# EAGLE schematic EEZ DIB DCP405 r3B3a (EAGLE 7.2.0)
Assembly variants: Farnell, TME

## Sheet 1 of 6: Power pre-regulator
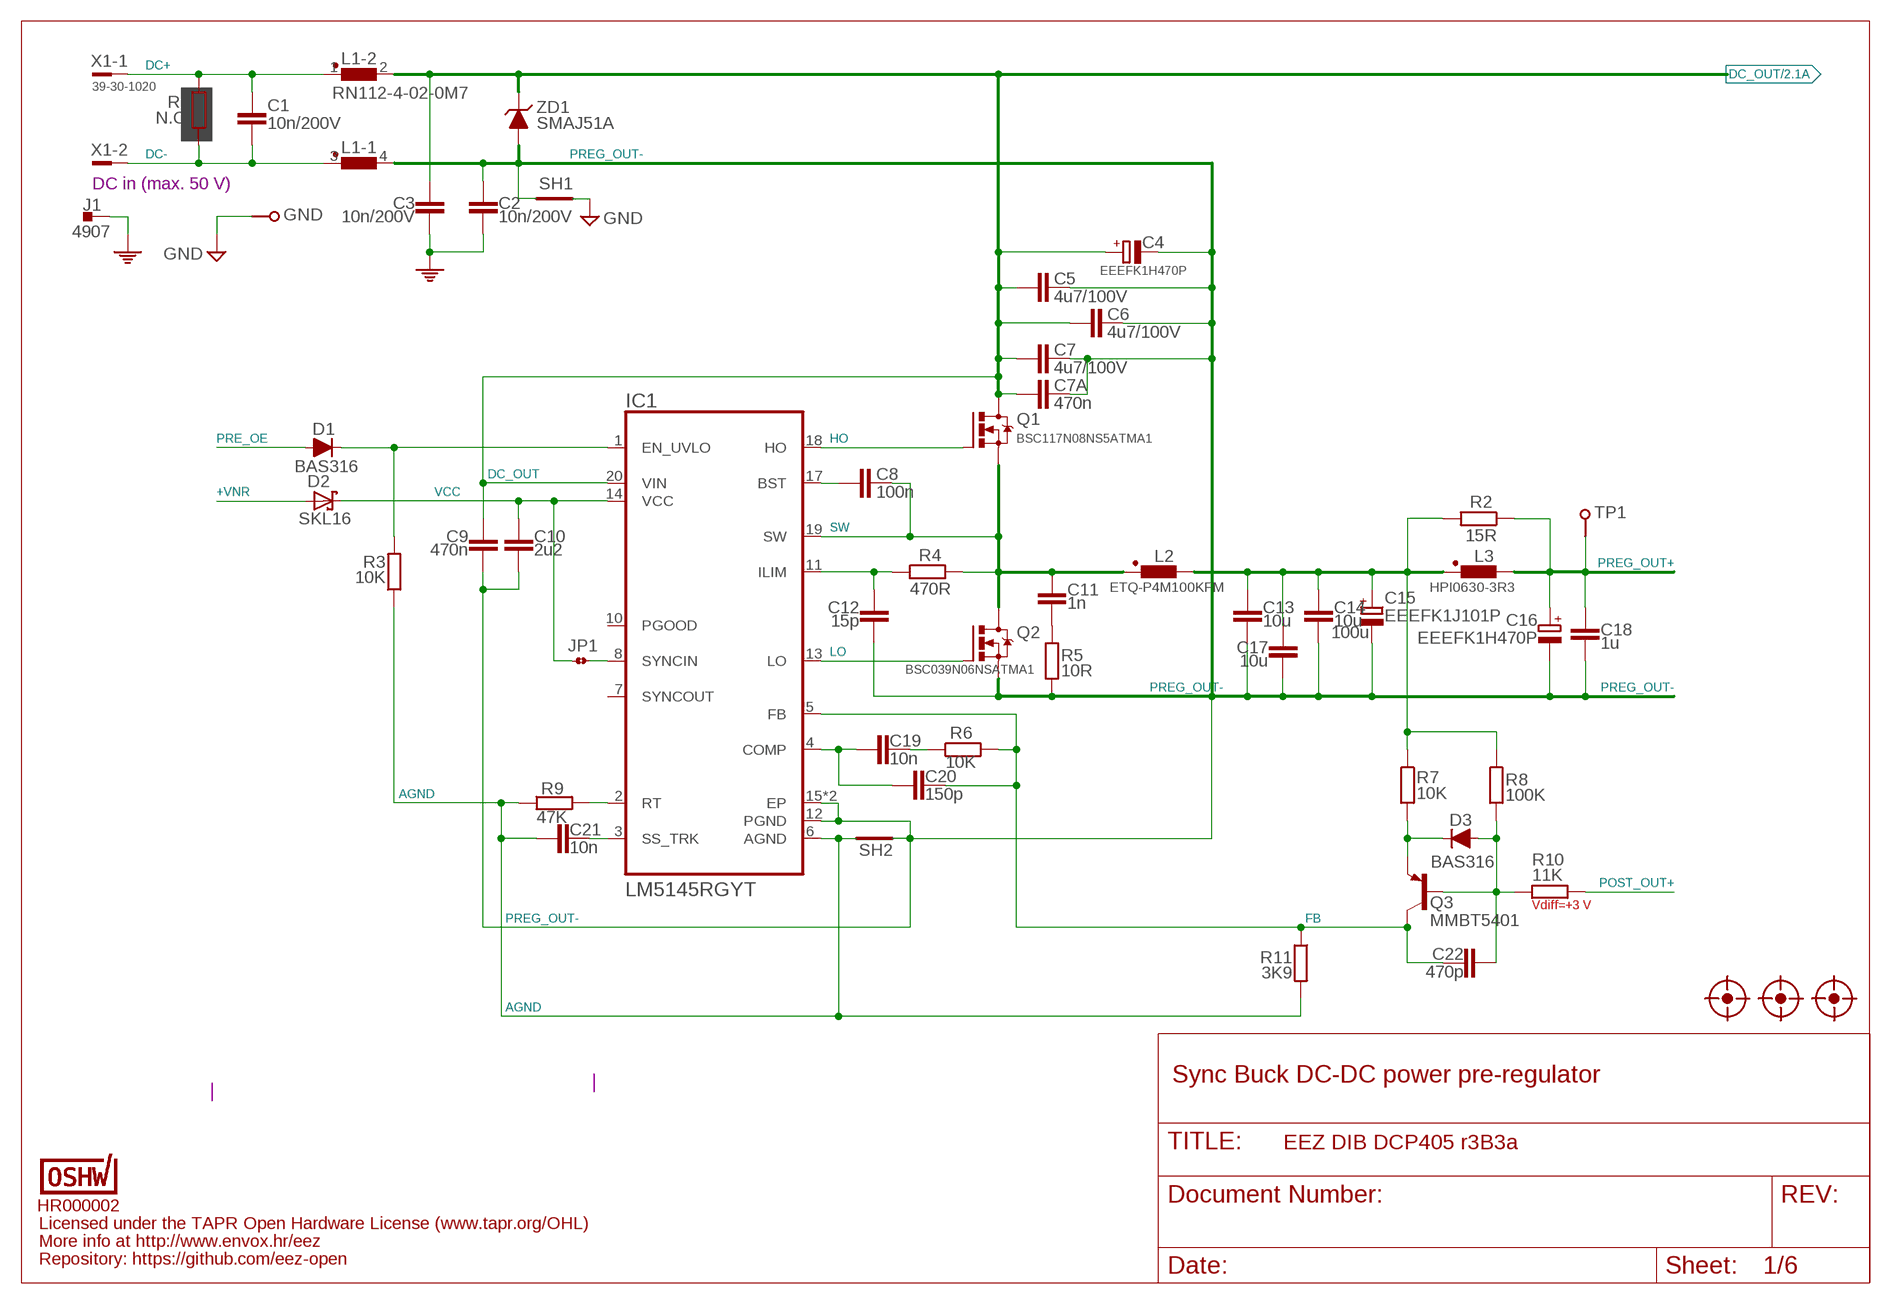
[diagram p0: schematic, sheet 1]

### Parts
C1  10n/200V  C-EUC1206  [C1206]
C2  10n/200V  C-EUC1206  [C1206]
C3  10n/200V  C-EUC1206  [C1206]
C4  EEEFK1H470P  ECAPSMD8.3MM/HA0  [CAPAE830X1050N]
C5  4u7/100V  C-EUC1210  [C1210]
C6  4u7/100V  C-EUC1210  [C1210]
C7  4u7/100V  C-EUC1210  [C1210]
C7A  470n  C-EUC0805  [C0805]
C8  100n  C-EUC0603  [C0603]
C9  470n  C-EUC0805  [C0805]
C10  2u2  C-EUC1206  [C1206]
C11  1n  C-EUC0805  [C0805]
C12  15p  C-EUC0805  [C0805]
C13  10u  C-EUC1210  [C1210]
C14  10u  C-EUC1210  [C1210]
C15  EEEFK1J101P  ECAP10X10  [CAPAE1030X1050N]
C16  EEEFK1H470P  ECAPSMD8.3MM/HA0  [CAPAE830X1050N]
C17  10u  C-EUC1210  [C1210]
C18  1u  C-EUC0805  [C0805]
C19  10n  C-EUC0805  [C0805]
C20  150p  C-EUC0805  [C0805]
C21  10n  C-EUC0805  [C0805]
C22  470p  C-EUC0805  [C0805]
D1  BAS316  DIODESOD323R  [SOD323-R]
D2  SKL16  SCHOTTKYSOD123  [SOD123]
D3  BAS316  DIODESOD323R  [SOD323-R]
FM1  FIDUCIAL_2  [FIDUCIAL_DUAL]
FM2  FIDUCIAL_2  [FIDUCIAL_DUAL]
FM3  FIDUCIAL_2  [FIDUCIAL_DUAL]
GND  PCB_TEST_TABSHIELD  [PCB_SHIELD_TAB]
IC1  LM5145RGYT  LM5145RGYR  [RGY0020B]
J1  4907  PCB_TAB-4907  [PCB_TAB-4907]
JP1  JP2-CUT-0805  [R_0805]
L1  RN112-4-02-0M7  RN112  [RN112]
L2  ETQ-P4M100KFM  PANASONIC_ETQ-P4_KFM  [PANASONIC_ETQ-P4_KFM]
L3  HPI0630-3R3  COILCRAFT_HPI0630  [COILCRAFT_HPI0630]
OSHWA  HR000002  OSHWA-CERT-SMALL  [CERT-SMALL-SILK]
Q1  BSC117N08NS5ATMA1  N-MOSFETTDSON-8  [TDSON-8]
Q2  BSC039N06NSATMA1  N-MOSFETTDSON-8  [TDSON-8]
Q3  MMBT5401  BC857B-PNP-SOT23-BEC  [SOT23-BEC]
R1  N.C.  R-EU_R2512  [R2512]
R2  15R  R-EU_R2010  [R2010]
R3  10K  R-EU_R0805  [R0805]
R4  470R  R-EU_R0805  [R0805]
R5  10R  R-EU_R1206  [R1206]
R6  10K  R-EU_R0805  [R0805]
R7  10K  R-EU_R0805  [R0805]
R8  100K  R-EU_R0805  [R0805]
R9  47K  R-EU_R0805  [R0805]
R10  11K  R-EU_R0805  [R0805]
R11  3K9  R-EU_R0805  [R0805]
SH1  SHORTNOHOLE  [SHORT_NOHOLE]
SH2  SHORTNOHOLE  [SHORT_NOHOLE]
TP1  TEST-PIN_0.9MM  [TEST-PIN_0.9MM]
X1  39-30-1020  MINIFIT_39301020  [MINIFIT_39301020]
ZD1  SMAJ51A  P6SMB68A  [DO214AA]

### Nets
+VNR: D2.A ; also sheet 2
AGND: C21.2 IC1.6(AGND) R3.1 R9.1 R11.2 SH2.1(GND_A)
DC+: C1.2 L1.1 R1.2 X1.1
DC-: C1.1 L1.3 R1.1 X1.2
DC_OUT: C3.2 C4.+ C5.1 C6.1 C7.1 C7A.2 C9.2 IC1.20(VIN) L1.2 Q1.5(D) Q1.6(D) Q1.7(D) Q1.8(D) ZD1.C ; also sheet 2
FB: C20.1 C22.1 IC1.5(FB) Q3.C R6.2 R11.1
GND: GND.1 SH1.2(GND_B) ; also sheet 2,3,4,5,6
HO: IC1.18(HO) Q1.4(G)
L_OUT: C13.1 C14.1 C15.+ C17.1 L2.2 L3.1 R2.2 R7.1 R8.1
LO: IC1.13(LO) Q2.4(G)
N$7: IC1.8(SYNCIN) JP1.2
N$8: D1.C IC1.1(EN_UVLO) R3.2
N$16: D3.C Q3.E R7.2
N$38: C19.1 R6.1
N$40: C8.1 IC1.17(BST)
N$43: IC1.2(RT) R9.2
N$45: C19.2 C20.2 IC1.4(COMP)
N$46: C12.1 IC1.11(ILIM) R4.1
N$53: C21.1 IC1.3(SS_TRK)
N$59: C11.2 R5.2
N$79: C22.2 D3.A Q3.B R8.2 R10.1
PE: C2.2 C3.1 J1.1 J1.2 ; also sheet 6
POST_OUT+: R10.2 ; also sheet 3,6
PRE_OE: D1.A ; also sheet 4
PREG_OUT+: C16.+ C18.2 L3.2 R2.1 TP1.1 ; also sheet 3
PREG_OUT-: C2.1 C4.- C5.2 C6.2 C7.2 C7A.1 C9.1 C10.1 C12.2 C13.2 C14.2 C15.- C16.- C17.2 C18.1 IC1.12(PGND) IC1.15(EP) IC1.21(EP) L1.4 Q2.1(S) Q2.2(S) Q2.3(S) R5.1 SH1.1(GND_A) SH2.2(GND_B) ZD1.A ; also sheet 3
SW: C8.2 C11.1 IC1.19(SW) L2.1 Q1.1(S) Q1.2(S) Q1.3(S) Q2.5(D) Q2.6(D) Q2.7(D) Q2.8(D) R4.2
VCC: C10.2 D2.C IC1.14(VCC) JP1.1
Unconnected: IC1.7(SYNCOUT) IC1.10(PGOOD)

### Notes on the sheet
- DC in (max. 50 V)
- 100u
- Vdiff=+3 V
- Sync Buck DC-DC power pre-regulator
- Licensed under the TAPR Open Hardware License (www.tapr.org/OHL)
- More info at http://www.envox.hr/eez
- Repository: https://github.com/eez-open

## Sheet 2 of 6: Bias power, DIB interface
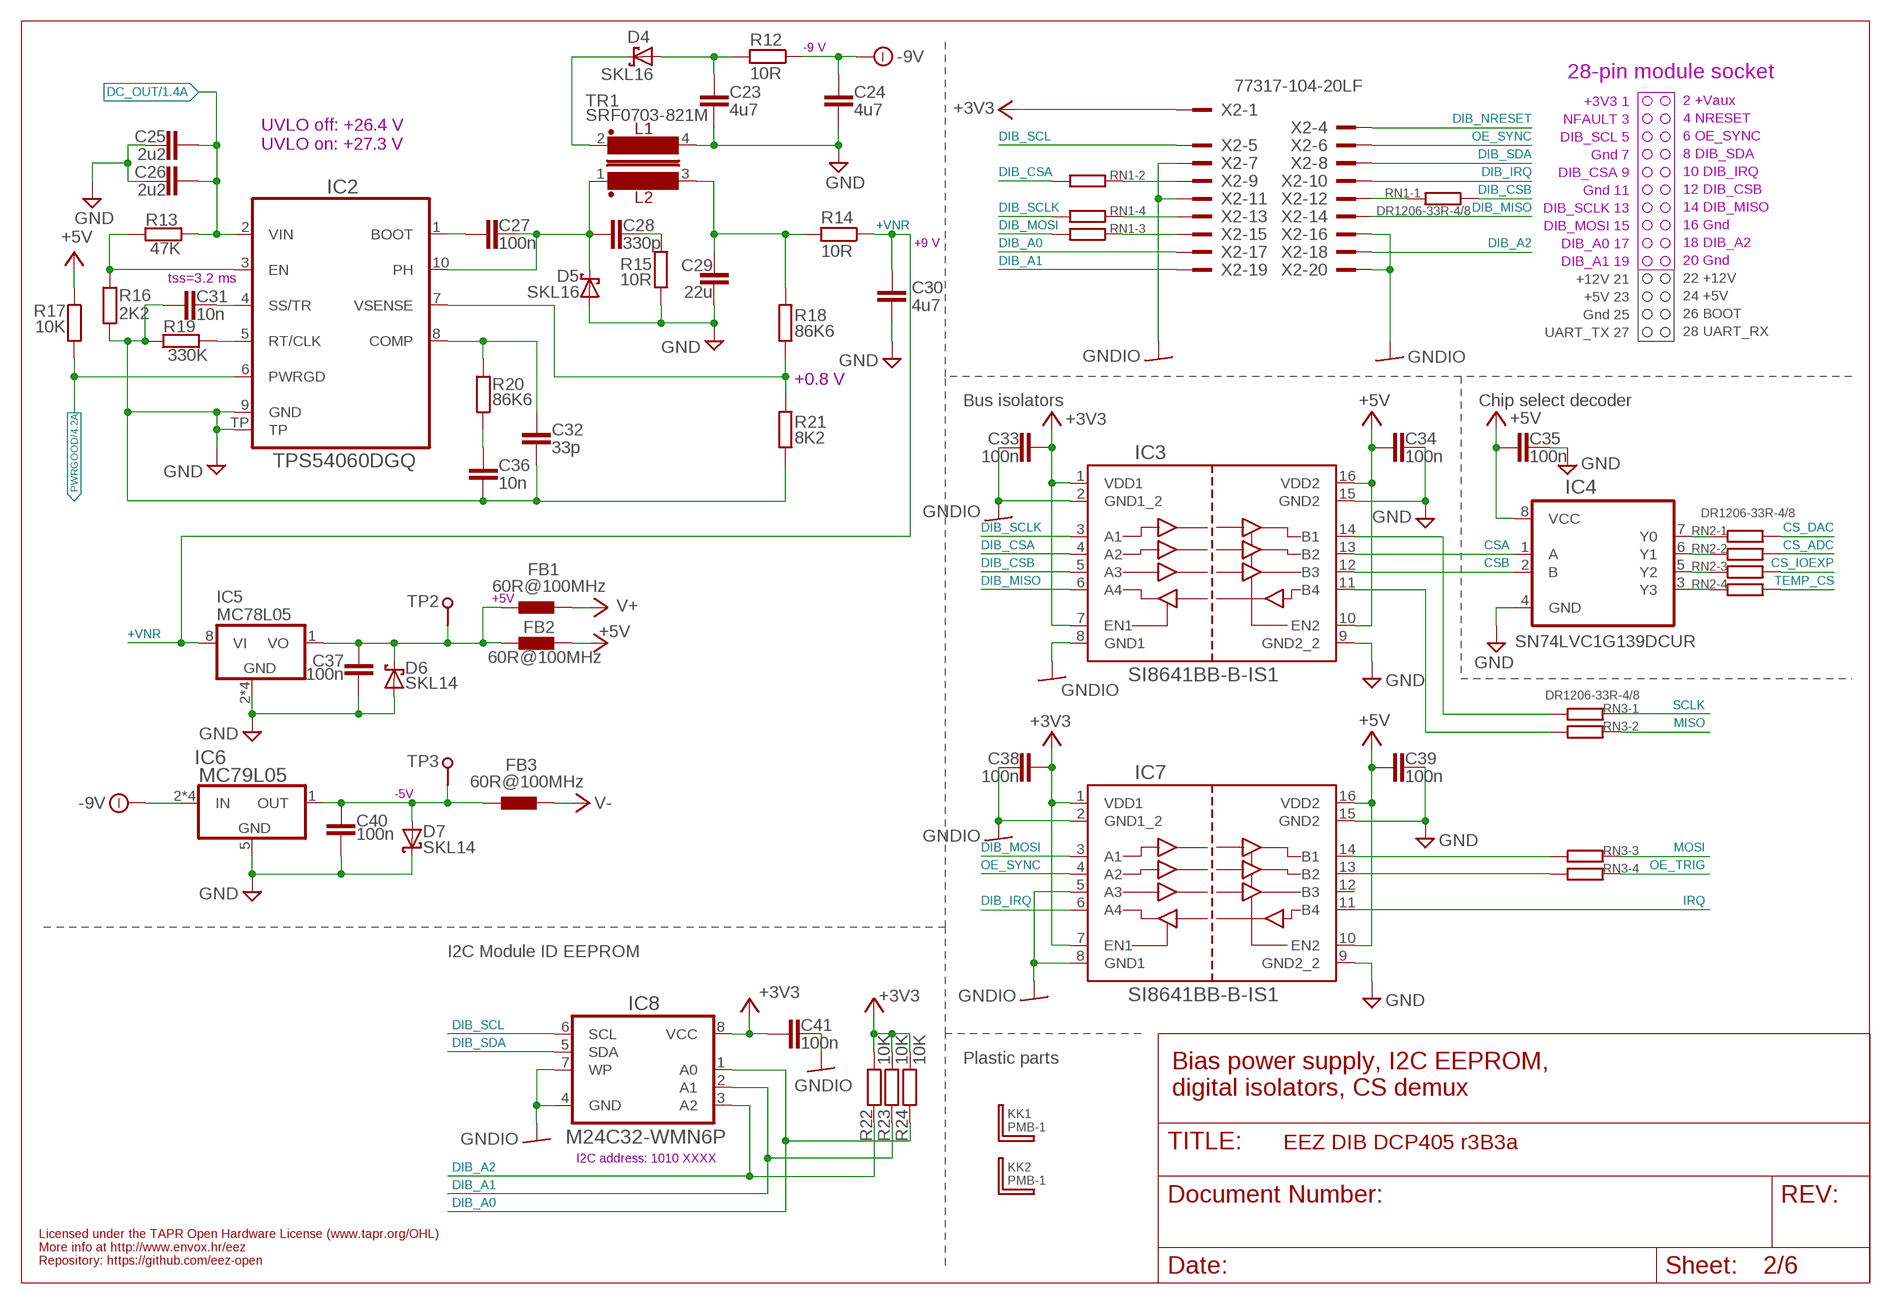
[diagram p1: schematic, sheet 2]

### Parts
C23  4u7  C-EUC1206  [C1206]
C24  4u7  C-EUC1206  [C1206]
C25  2u2  C-EUC1206  [C1206]
C26  2u2  C-EUC1206  [C1206]
C27  100n  C-EUC0603  [C0603]
C28  330p  C-EUC0805  [C0805]
C29  22u  C-EUC1210  [C1210]
C30  4u7  C-EUC1206  [C1206]
C31  10n  C-EUC0805  [C0805]
C32  33p  C-EUC0805  [C0805]
C33  100n  C-EUC0603  [C0603]
C34  100n  C-EUC0603  [C0603]
C35  100n  C-EUC0603  [C0603]
C36  10n  C-EUC0805  [C0805]
C37  100n  C-EUC0603  [C0603]
C38  100n  C-EUC0603  [C0603]
C39  100n  C-EUC0603  [C0603]
C40  100n  C-EUC0603  [C0603]
C41  100n  C-EUC0603  [C0603]
D4  SKL16  SCHOTTKYSOD123  [SOD123]
D5  SKL16  SCHOTTKYSOD123  [SOD123]
D6  SKL14  SCHOTTKYSOD123  [SOD123]
D7  SKL14  SCHOTTKYSOD123  [SOD123]
FB1  60R@100MHz  FERRITE_BEAD0603  [BEAD0603]
FB2  60R@100MHz  FERRITE_BEAD0603  [BEAD0603]
FB3  60R@100MHz  FERRITE_BEAD0603  [BEAD0603]
IC2  TPS54060DGQ  [SOP50P490X110-11N]
IC3  SI8641BB-B-IS1  SI8641NSOIC-16  [SOIC-16]
IC4  SN74LVC1G139DCUR  SN74LVC1G139-VSSOP  [DCU8]
IC5  MC78L05  MC78LXXSOIC8  [SOIC127P600X173-8N]
IC6  MC79L05  MC79LXXSOIC  [SOIC127P600X173-8N]
IC7  SI8641BB-B-IS1  SI8641NSOIC-16  [SOIC-16]
IC8  M24C32-WMN6P  AT24CXXSOIC8  [SOIC127P600X173-8N]
KK1  PMB-1  PCB-MB  [PCB-MB]
KK2  PMB-1  PCB-MB  [PCB-MB]
R12  10R  R-EU_R1206  [R1206]
R13  47K  R-EU_R0805  [R0805]
R14  10R  R-EU_R1206  [R1206]
R15  10R  R-EU_R1206  [R1206]
R16  2K2  R-EU_R0805  [R0805]
R17  10K  R-EU_R0805  [R0805]
R18  86K6  R-EU_R0805  [R0805]
R19  330K  R-EU_R0805  [R0805]
R20  86K6  R-EU_R0805  [R0805]
R21  8K2  R-EU_R0805  [R0805]
R22  10K  R-EU_R0805  [R0805]
R23  10K  R-EU_R0805  [R0805]
R24  10K  R-EU_R0805  [R0805]
RN1  DR1206-33R-4/8  R_ARRAY4  [CAY16]
RN2  DR1206-33R-4/8  R_ARRAY4  [CAY16]
RN3  DR1206-33R-4/8  R_ARRAY4  [CAY16]
TP2  TEST-PIN_0.9MM  [TEST-PIN_0.9MM]
TP3  TEST-PIN_0.9MM  [TEST-PIN_0.9MM]
TR1  SRF0703-821M  BOURNS_SRF0703INV  [SRF0703]
X2  77317-104-20LF  [77317-104-20LF]

### Nets
+3V3: C33.1 C38.1 C41.2 IC3.1(VDD1) IC3.7(EN1) IC7.1(VDD1) IC7.7(EN1) IC8.8(VCC) R22.1 R23.1 R24.1 X2.1
+5V: C34.2 C35.1 C39.2 FB2.P$2 IC3.10(EN2) IC3.16(VDD2) IC4.8(VCC) IC7.10(EN2) IC7.16(VDD2) R17.1 ; also sheet 4,5,6
+5VOUT: C37.1 D6.C FB1.P$1 FB2.P$1 IC5.1(VO) TP2.1
+VNR: C30.1 IC5.8(VI) R14.1 ; also sheet 1
-9V: C24.1 IC6.2(IN) IC6.3(IN) IC6.6(IN) IC6.7(IN) R12.1 ; also sheet 3
CS_ADC: RN2.7 ; also sheet 4
CS_DAC: RN2.8 ; also sheet 4
CS_IOEXP: RN2.6 ; also sheet 4
CSA: IC3.13(B2) IC4.1(A)
CSB: IC3.12(B3) IC4.2(B)
DC_OUT: C25.1 C26.1 IC2.2(VIN) R13.2 ; also sheet 1
DIB_A0: IC8.1(A0) R24.2 X2.17
DIB_A1: IC8.2(A1) R23.2 X2.19
DIB_A2: IC8.3(A2) R22.2 X2.18
DIB_CSA: IC3.4(A2) RN1.2
DIB_CSB: IC3.5(A3) RN1.1
DIB_IRQ: IC7.6(A4) X2.10
DIB_MISO: IC3.6(A4) X2.14
DIB_MOSI: IC7.3(A1) RN1.3
DIB_NRESET: X2.4
DIB_SCL: IC8.6(SCL) X2.5
DIB_SCLK: IC3.3(A1) RN1.4
DIB_SDA: IC8.5(SDA) X2.8
GND: C23.2 C24.2 C25.2 C26.2 C29.2 C30.2 C31.2 C32.1 C34.1 C35.2 C36.1 C37.2 C39.1 C40.1 D5.A D6.A D7.C IC2.9(GND) IC2.TP IC3.9(GND2_2) IC3.15(GND2) IC4.4(GND) IC5.2(GND) IC5.3(GND) IC5.6(GND) IC5.7(GND) IC6.5(GND) IC7.9(GND2_2) IC7.15(GND2) R15.1 R16.1 R19.1 R21.1 TR1.4 ; also sheet 1,3,4,5,6
GNDIO: C33.2 C38.2 C41.1 IC3.2(GND1_2) IC3.8(GND1) IC7.2(GND1_2) IC7.5(A3) IC7.8(GND1) IC8.4(GND) IC8.7(WP) X2.7 X2.11 X2.16 X2.20
IRQ: IC7.11(B4) ; also sheet 4
MISO: RN3.7 ; also sheet 4
MOSI: RN3.6 ; also sheet 4
N$3: IC7.13(B2) RN3.4
N$4: IC4.5(Y2) RN2.3
N$6: IC4.7(Y0) RN2.1
N$9: IC3.11(B4) RN3.2
N$15: RN1.7 X2.9
N$22: IC4.6(Y1) RN2.2
N$23: RN1.5 X2.13
N$26: C28.2 R15.2
N$27: RN1.6 X2.15
N$29: C40.2 D7.A FB3.P$1 IC6.1(OUT) TP3.1
N$30: RN1.8 X2.12
N$34: IC2.3(EN) R13.1 R16.2
N$41: C31.1 IC2.4(SS/TR)
N$48: IC2.5(RT/CLK) R19.2
N$50: C32.2 IC2.8(COMP) R20.2
N$51: C36.2 R20.1
N$52: IC4.3(Y3) RN2.4
N$60: C27.2 IC2.1(BOOT)
N$61: IC7.14(B1) RN3.3
N$62: IC2.7(VSENSE) R18.1 R21.2
N$122: IC3.14(B1) RN3.1
N$179: C23.1 D4.A R12.2
OE_SYNC: IC7.4(A2) X2.6
OE_TRIG: RN3.5 ; also sheet 4
PH: C27.1 C28.1 D5.C IC2.10(PH) TR1.1
PWRGOOD: IC2.6(PWRGD) R17.2 ; also sheet 4
SCLK: RN3.8 ; also sheet 4
TEMP_CS: RN2.5 ; also sheet 4
V+: FB1.P$2 ; also sheet 3,4,5
V-: FB3.P$2 ; also sheet 3,5
VOUT+: C29.1 R14.2 R18.2 TR1.3
VOUT-: D4.C TR1.2
Unconnected: IC7.12(B3) X2.2 X2.3

### Notes on the sheet
- -9 V
- 28-pin module socket
- +3V3 1
- 2 +Vaux
- NFAULT 3
- 4 NRESET
- DIB_SCL 5
- 6 OE_SYNC
- UVLO off: +26.4 V
  UVLO on: +27.3 V
- Gnd 7
- 8 DIB_SDA
- DIB_CSA 9
- 10 DIB_IRQ
- Gnd 11
- 12 DIB_CSB
- DIB_SCLK 13
- 14 DIB_MISO
- DIB_MOSI 15
- 16 Gnd
- +9 V | DIB_A0 17
- 18 DIB_A2
- DIB_A1 19
- 20 Gnd
- +12V 21
- tss=3.2 ms | 22 +12V
- +5V 23
- 24 +5V
- Gnd 25
- 26 BOOT
- UART_TX 27
- 28 UART_RX
- +0.8 V
- Bus isolators | Chip select decoder
- +5V
- -5V
- I2C Module ID EEPROM
- Plastic parts
- Bias power supply, I2C EEPROM,
  digital isolators, CS demux
- I2C address: 1010 XXXX
- Licensed under the TAPR Open Hardware License (www.tapr.org/OHL)
- More info at http://www.envox.hr/eez
- Repository: https://github.com/eez-open

## Sheet 3 of 6: Post-regulator
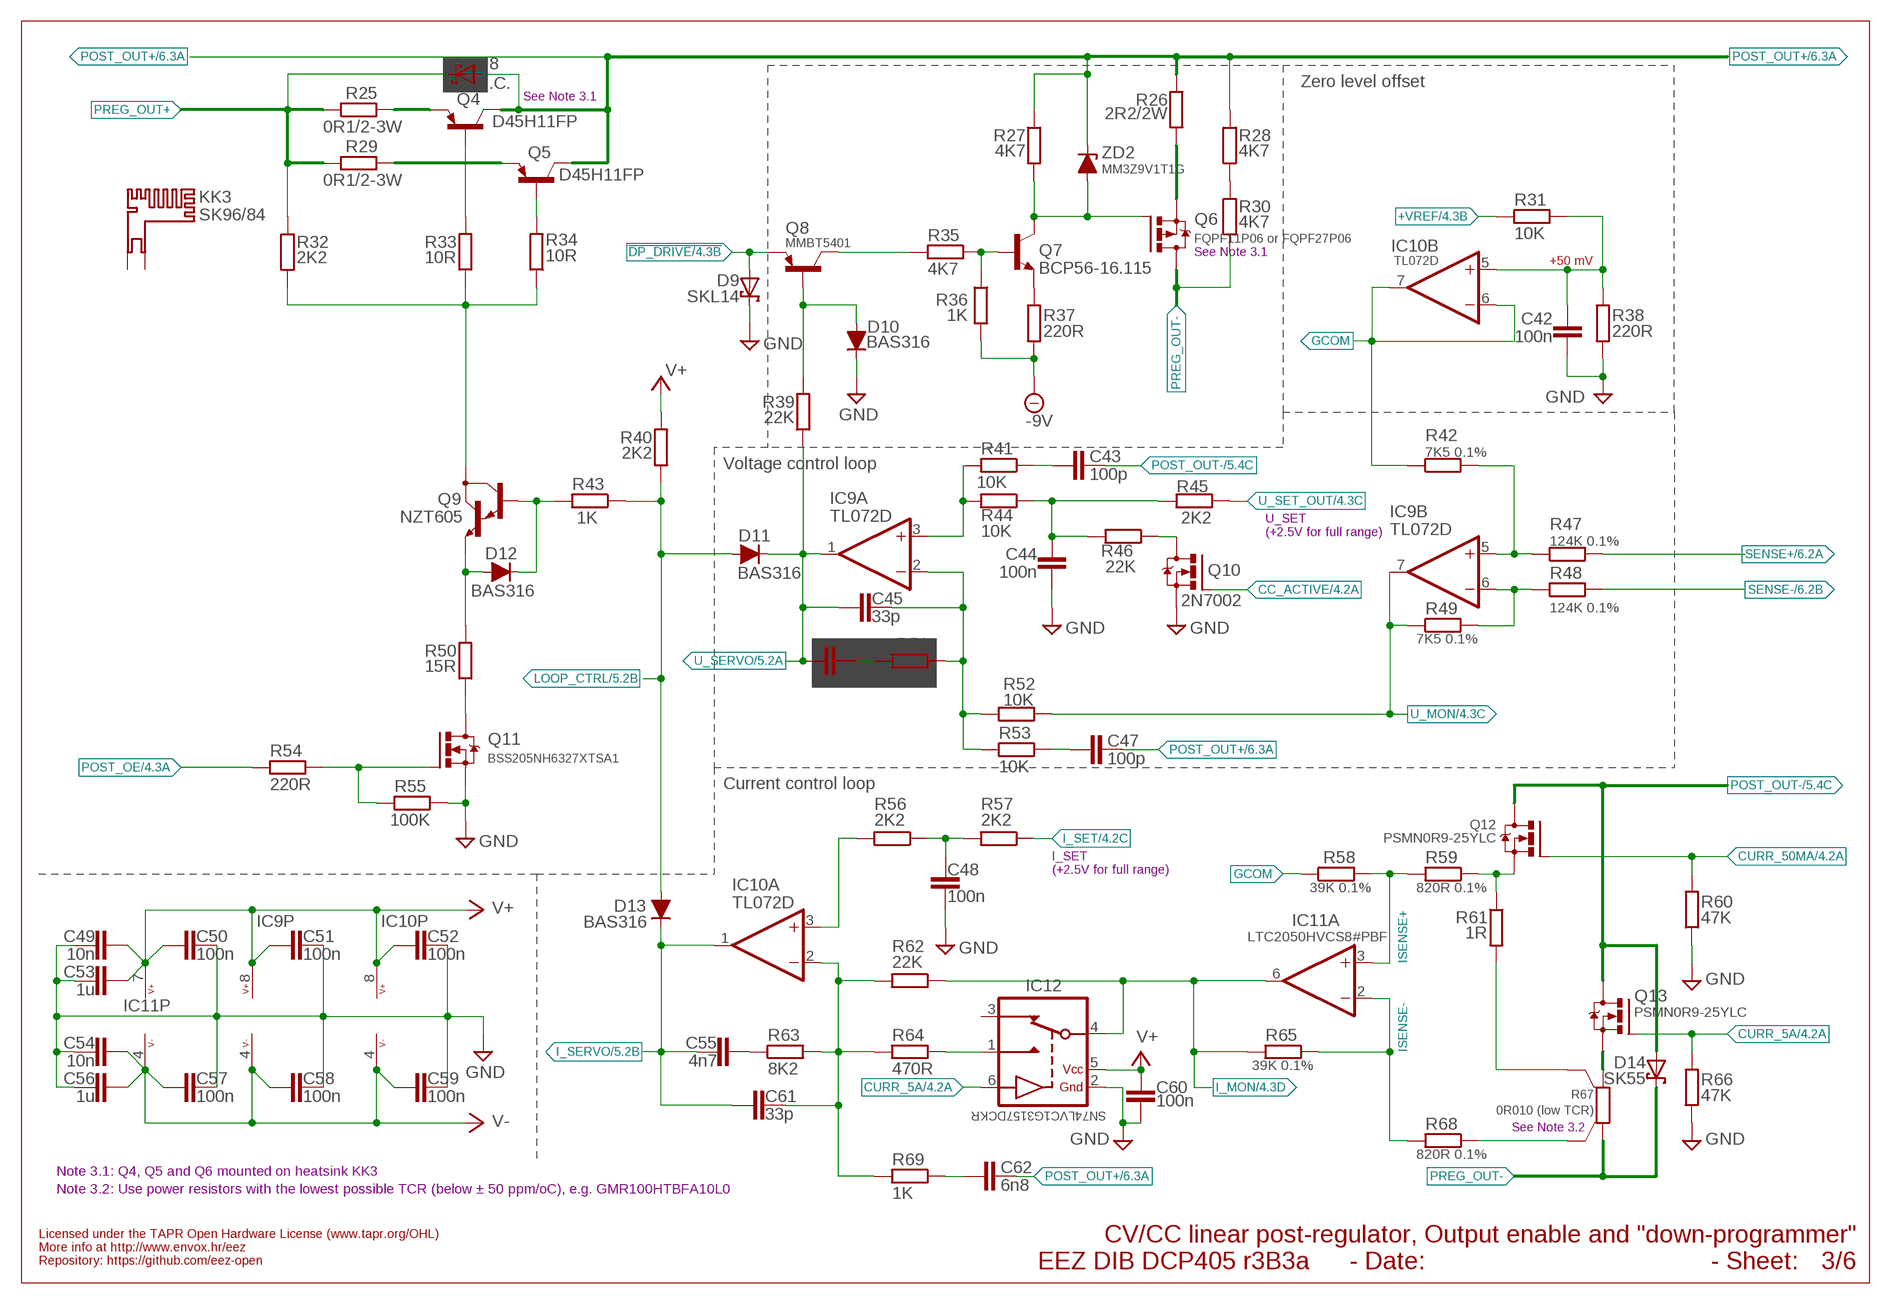
[diagram p2: schematic, sheet 3]

### Parts
C42  100n  C-EUC0603  [C0603]
C43  100p  C-EUC0805  [C0805]
C44  100n  C-EUC0603  [C0603]
C45  33p  C-EUC0805  [C0805]
C46  N.C.  C-EUC0805  [C0805]
C47  100p  C-EUC0805  [C0805]
C48  100n  C-EUC0603  [C0603]
C49  10n  C-EUC0805  [C0805]
C50  100n  C-EUC0603  [C0603]
C51  100n  C-EUC0603  [C0603]
C52  100n  C-EUC0603  [C0603]
C53  1u  C-EUC0805  [C0805]
C54  10n  C-EUC0805  [C0805]
C55  4n7  C-EUC0805  [C0805]
C56  1u  C-EUC0805  [C0805]
C57  100n  C-EUC0603  [C0603]
C58  100n  C-EUC0603  [C0603]
C59  100n  C-EUC0603  [C0603]
C60  100n  C-EUC0603  [C0603]
C61  33p  C-EUC0805  [C0805]
C62  6n8  C-EUC0805  [C0805]
D8  N.C.  SCHOTTKYSOD123  [SOD123]
D9  SKL14  SCHOTTKYSOD123  [SOD123]
D10  BAS316  DIODESOD323R  [SOD323-R]
D11  BAS316  DIODESOD323R  [SOD323-R]
D12  BAS316  DIODESOD323R  [SOD323-R]
D13  BAS316  DIODESOD323R  [SOD323-R]
D14  SK55  SCHOTTKYSMB  [SMB]
IC9  TL072D  TL072SOIC8  [SOIC127P600X173-8N]
IC10  TL072D  TL072SOIC8  [SOIC127P600X173-8N]
IC11  LTC2050HVCS8#PBF  OP27GSZSO8  [SOIC127P600X173-8N]
IC12  SN74LVC1G3157DCKR  SN74LVC1G3157-DCK  [SOT65P210X110-6N]
KK3  SK96/84  [SK96/84]
Q4  D45H11FP  D45H11-FPV  [TO220FP-V]
Q5  D45H11FP  D45H11-FPV  [TO220FP-V]
Q6  FQPF11P06 or FQPF27P06  P-MOSFET-FPV  [TO220FP-V]
Q7  BCP56-16.115  BCP56  [SOT230P700X180-4N]
Q8  MMBT5401  BC857B-PNP-SOT23-BEC  [SOT23-BEC]
Q9  NZT605  [SOT230P700X180-4N]
Q10  2N7002  [SOT103P240X110-3N]
Q11  BSS205NH6327XTSA1  2N7002  [SOT103P240X110-3N]
Q12  PSMN0R9-25YLC  N-MOSFETLFPAK  [SOT669]
Q13  PSMN0R9-25YLC  N-MOSFETLFPAK  [SOT669]
R25  0R1/2-3W  R-EU_R2512  [R2512]
R26  2R2/2W  R-EU_R2512  [R2512]
R27  4K7  R-EU_R0805  [R0805]
R28  4K7  R-EU_R0805  [R0805]
R29  0R1/2-3W  R-EU_R2512  [R2512]
R30  4K7  R-EU_R0805  [R0805]
R31  10K  R-EU_R0805  [R0805]
R32  2K2  R-EU_R0805  [R0805]
R33  10R  R-EU_R1206  [R1206]
R34  10R  R-EU_R1206  [R1206]
R35  4K7  R-EU_R0805  [R0805]
R36  1K  R-EU_R0805  [R0805]
R37  220R  R-EU_R0805  [R0805]
R38  220R  R-EU_R0805  [R0805]
R39  22K  R-EU_R0805  [R0805]
R40  2K2  R-EU_R0805  [R0805]
R41  10K  R-EU_R0805  [R0805]
R42  7K5 0.1%  R-EU_R0805  [R0805]
R43  1K  R-EU_R0805  [R0805]
R44  10K  R-EU_R0805  [R0805]
R45  2K2  R-EU_R0805  [R0805]
R46  22K  R-EU_R0805  [R0805]
R47  124K 0.1%  R-EU_R0805  [R0805]
R48  124K 0.1%  R-EU_R0805  [R0805]
R49  7K5 0.1%  R-EU_R0805  [R0805]
R50  15R  R-EU_R2010  [R2010]
R51  N.C.  R-EU_R0805  [R0805]
R52  10K  R-EU_R0805  [R0805]
R53  10K  R-EU_R0805  [R0805]
R54  220R  R-EU_R0805  [R0805]
R55  100K  R-EU_R0805  [R0805]
R56  2K2  R-EU_R0805  [R0805]
R57  2K2  R-EU_R0805  [R0805]
R58  39K 0.1%  R-EU_R0805  [R0805]
R59  820R 0.1%  R-EU_R0805  [R0805]
R60  47K  R-EU_R0805  [R0805]
R61  1R  R-EU_R1206  [R1206]
R62  22K  R-EU_R0805  [R0805]
R63  8K2  R-EU_R0805  [R0805]
R64  470R  R-EU_R0805  [R0805]
R65  39K 0.1%  R-EU_R0805  [R0805]
R66  47K  R-EU_R0805  [R0805]
R67  0R010 (low TCR)  R-EU_4WIRE2512  [R_2512-4WIRE]
R68  820R 0.1%  R-EU_R0805  [R0805]
R69  1K  R-EU_R0805  [R0805]
ZD2  MM3Z9V1T1G  ZENER-DIODESOD323R  [SOD323-R]

### Nets
5A_S: Q13.1(S) Q13.2(S) Q13.3(S) R67.2
50MA_S: Q12.1(S) Q12.2(S) Q12.3(S) R59.1 R61.1
!DP_DRIVE: D9.A Q8.E ; also sheet 4
+VREF: R31.1 ; also sheet 4
-9V: R36.2 R37.2 ; also sheet 2
CC_ACTIVE: Q10.1(G) ; also sheet 4,5
CURR_5A: IC12.6(CTRL) Q13.4(G) R66.2 ; also sheet 4
CURR_50MA: Q12.4(G) R60.2 ; also sheet 4
DARL_C1: Q9.2(C) Q9.4(C) R32.1 R33.1 R34.1
DP_S: Q6.3(S) R26.1
GCOM: IC10.6(B:-IN) IC10.7(B:OUT) R42.1 R58.1
GND: C42.2 C44.2 C48.2 C49.1 C50.2 C51.1 C52.1 C53.1 C54.1 C56.1 C57.2 C58.1 C59.1 C60.2 D9.C D10.C IC12.2(GND) Q10.2(S) Q11.2(S) R38.2 R55.1 R60.1 R66.1 ; also sheet 1,2,4,5,6
I_MON: IC11.6(A:OUT) IC12.4(COM) R62.1 R65.2 ; also sheet 4
I_SERVO: C55.2 C61.2 D13.C IC10.1(A:OUT) ; also sheet 5
I_SET: R57.1 ; also sheet 4
ISENSE+: IC11.3(A:+IN) R58.2 R59.2
ISENSE-: IC11.2(A:-IN) R65.1 R68.2
LOOP_CTRL: D11.A D13.A R40.1 R43.1 ; also sheet 5
N$2: Q10.3(D) R46.1
N$10: C48.1 R56.1 R57.2
N$11: R61.2 R67.2S
N$14: C46.1 R51.2
N$37: C55.1 R63.1
N$54: Q5.1(B) R34.2
N$57: IC12.1(NO) R64.1
N$82: IC10.3(A:+IN) R56.2
N$83: IC9.3(A:+IN) R41.2 R44.2
N$84: C45.1 IC9.2(A:-IN) R51.1 R52.2 R53.2
N$85: Q4.1(B) R33.2
N$86: D12.A Q9.3(E) R50.2
N$87: Q11.3(D) R50.1
N$88: C62.2 R69.1
N$89: C61.1 IC10.2(A:-IN) R62.2 R63.2 R64.2 R69.2
N$90: C43.2 R41.1
N$91: C47.2 R53.1
N$92: R28.1 R30.2
N$93: Q7.1(B) R35.1 R36.1
N$95: Q8.C R35.2
N$96: D10.A Q8.B R39.2
N$97: Q11.1(G) R54.1 R55.2
N$98: Q7.3(E) R37.1
N$99: D12.C Q9.1(B) R43.2
N$102: C42.1 IC10.5(B:+IN) R31.2 R38.1
N$150: IC9.5(B:+IN) R42.2 R47.1
N$158: IC9.6(B:-IN) R48.1 R49.2
N$200: R67.1S R68.1
PASS_E1: Q4.3(E) R25.2
PASS_E2: Q5.3(E) R29.2
POST_OE: R54.2 ; also sheet 4
POST_OUT+: C47.1 C62.1 D8.A Q4.2(C) Q5.2(C) R26.2 R27.1 R28.2 ZD2.C ; also sheet 1,6
POST_OUT-: C43.1 D14.A Q12.MB(D) Q13.MB(D) ; also sheet 5,6
PREG_OUT+: D8.C R25.1 R29.1 R32.2 ; also sheet 1
PREG_OUT-: D14.C Q6.2(D) R30.1 R67.1 ; also sheet 1
Q7C: Q6.1(G) Q7.2(C) Q7.4(C) R27.2 ZD2.A
SENSE+: R47.2 ; also sheet 6
SENSE-: R48.2 ; also sheet 6
U_MON: IC9.7(B:OUT) R49.1 R52.1 ; also sheet 4,5
U_SERVO: C45.2 C46.2 D11.C IC9.1(A:OUT) R39.1 ; also sheet 5
U_SET_OUT: R45.1 ; also sheet 4,5
U_SET_OVP: C44.1 R44.1 R45.2 R46.2
V+: C49.2 C50.1 C51.2 C52.2 C53.2 C60.1 IC9.8(P:V+) IC10.8(P:V+) IC11.7(P:V+) IC12.5(VDD) R40.2 ; also sheet 2,4,5
V-: C54.2 C56.2 C57.1 C58.2 C59.2 IC9.4(P:V-) IC10.4(P:V-) IC11.4(P:V-) ; also sheet 2,5
Unconnected: IC12.3(NC) KK3.1 KK3.2

### Notes on the sheet
- Zero level offset
- See Note 3.1
- See Note 3.1
- +50 mV
- Voltage control loop
- U_SET
  (+2.5V for full range)
- Current control loop
- I_SET
  (+2.5V for full range)
- See Note 3.2
- Note 3.1: Q4, Q5 and Q6 mounted on heatsink KK3
- Note 3.2: Use power resistors with the lowest possible TCR (below ± 50 ppm/oC), e.g. GMR100HTBFA10L0
- Licensed under the TAPR Open Hardware License (www.tapr.org/OHL)
- CV/CC linear post-regulator, Output enable and "down-programmer"
- More info at http://www.envox.hr/eez
- Repository: https://github.com/eez-open
- - Date: | - Sheet:

## Sheet 4 of 6: Digital control, Vref
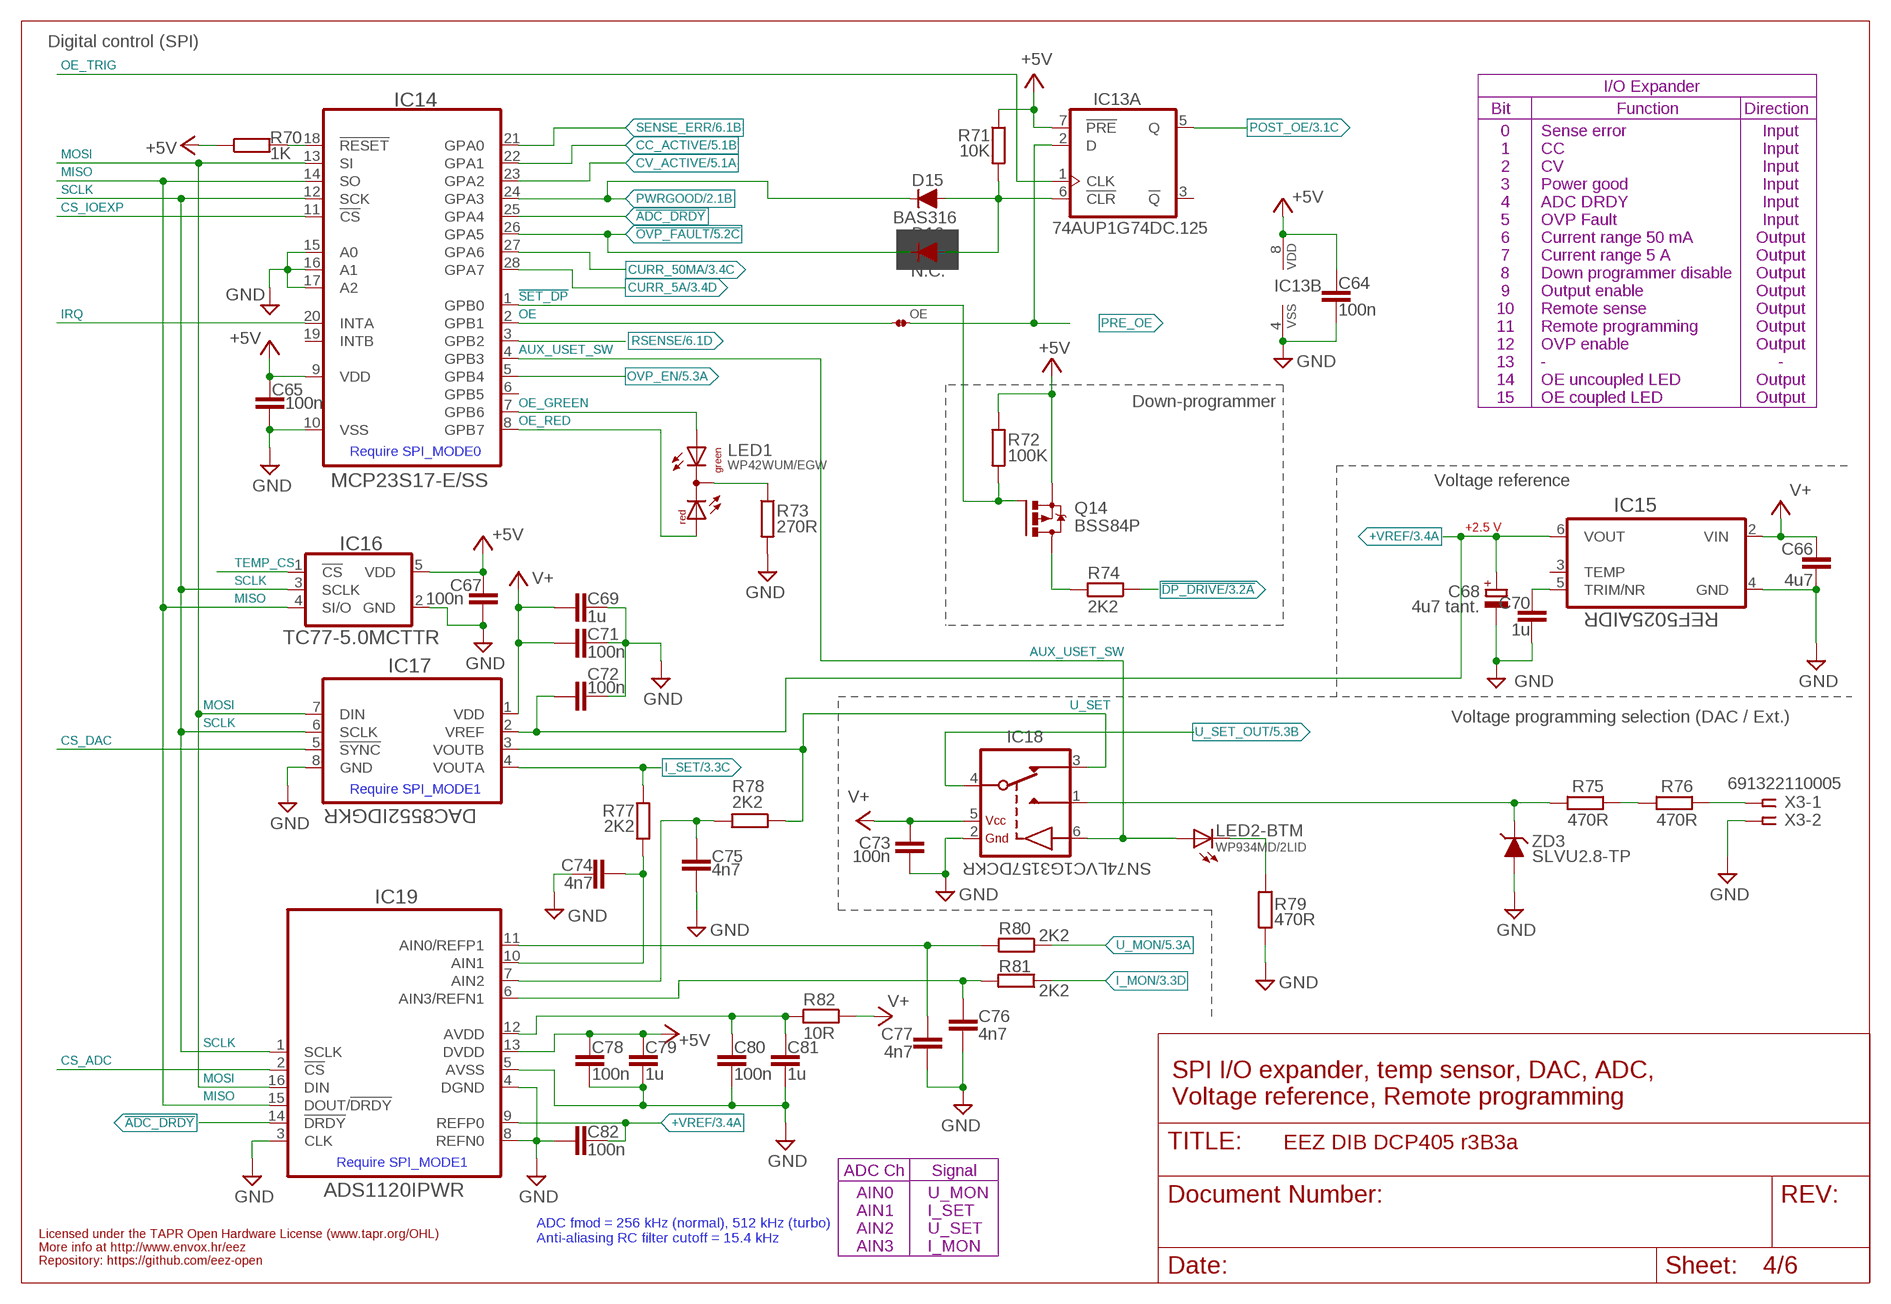
[diagram p3: schematic, sheet 4]

### Parts
C64  100n  C-EUC0603  [C0603]
C65  100n  C-EUC0603  [C0603]
C66  4u7  C-EUC1206  [C1206]
C67  100n  C-EUC0603  [C0603]
C68  4u7 tant.  ECAP1206  [EC1206]
C69  1u  C-EUC0805  [C0805]
C70  1u  C-EUC0805  [C0805]
C71  100n  C-EUC0603  [C0603]
C72  100n  C-EUC0603  [C0603]
C73  100n  C-EUC0603  [C0603]
C74  4n7  C-EUC0805  [C0805]
C75  4n7  C-EUC0805  [C0805]
C76  4n7  C-EUC0805  [C0805]
C77  4n7  C-EUC0805  [C0805]
C78  100n  C-EUC0603  [C0603]
C79  1u  C-EUC0805  [C0805]
C80  100n  C-EUC0603  [C0603]
C81  1u  C-EUC0805  [C0805]
C82  100n  C-EUC0603  [C0603]
D15  BAS316  DIODESOD323R  [SOD323-R]
D16  N.C.  DIODESOD323R  [SOD323-R]
IC13  74AUP1G74DC.125  SN74LVC1G74DCTR-VSSOP  [DCU8]
IC14  MCP23S17-E/SS  MCP23S17-E/SSSSOP  [SOP65P780X200-28N]
IC15  REF5025AIDR  REF50XX  [SOIC127P600X175-8N]
IC16  TC77-5.0MCTTR  TC77  [SOT23-5]
IC17  DAC8552IDGKR  DAC8552_DGK_8M  [DGK8-M]
IC18  SN74LVC1G3157DCKR  SN74LVC1G3157-DCK  [SOT65P210X110-6N]
IC19  ADS1120IPWR  ADS1120TSSOP-16  [PW(R-PDSO-G16)]
LED1  WP42WUM/EGW  LED_L-42WUM/1EGWT  [L-42WUM-1EGWT]
LED2  WP934MD/2LID  [WP934MD]
OE  JP2-NOCUT  [JP2-NOCUT]
Q14  BSS84P  IRLML2246TRPBF  [SOT95P237X112-3N]
R70  1K  R-EU_R0805  [R0805]
R71  10K  R-EU_R0805  [R0805]
R72  100K  R-EU_R0805  [R0805]
R73  270R  R-EU_R0805  [R0805]
R74  2K2  R-EU_R0805  [R0805]
R75  470R  R-EU_R0805  [R0805]
R76  470R  R-EU_R0805  [R0805]
R77  2K2  R-EU_R0805  [R0805]
R78  2K2  R-EU_R0805  [R0805]
R79  470R  R-EU_R0805  [R0805]
R80  2K2  R-EU_R0805  [R0805]
R81  2K2  R-EU_R0805  [R0805]
R82  10R  R-EU_R1206  [R1206]
X3  691322110005  MC1,5/5-G-3,5  [MC1,5/5-G-3,5]
ZD3  SLVU2.8-TP  SLVU2.8  [SOT23]

### Nets
!ADC_DRDY: IC14.25(GPA4) IC19.14(!DRDY)
!DP_DRIVE: R74.1 ; also sheet 3
!IOEXP_RST: IC14.18(!RESET) R70.2
!OVP_FAULT: D16.C IC14.26(GPA5) ; also sheet 5
!SET_DP: IC14.1(GPB0) Q14.1(G) R72.2
+5V: C64.2 C65.1 C67.1 C78.2 C79.2 IC13.7(A:!PRE) IC13.8(B:VDD) IC14.9(VDD) IC16.5(VDD) IC19.13(DVDD) Q14.2(S) R70.1 R71.1 R72.1 ; also sheet 2,5,6
+VREF: C68.+ C72.2 C82.2 IC15.6(VOUT) IC17.2(VREF) IC19.9(REFP0) ; also sheet 3
AUX_IN: IC18.1(NO) R75.1 ZD3.3(C)
AUX_USET_SW: IC14.4(GPB3) IC18.6(CTRL) LED2.BA(-BTM:A)
CC_ACTIVE: IC14.22(GPA1) ; also sheet 3,5
CS_ADC: IC19.2(!CS) ; also sheet 2
CS_DAC: IC17.5(!SYNC) ; also sheet 2
CS_IOEXP: IC14.11(!CS) ; also sheet 2
CURR_5A: IC14.28(GPA7) ; also sheet 3
CURR_50MA: IC14.27(GPA6) ; also sheet 3
CV_ACTIVE: IC14.23(GPA2) ; also sheet 5
GND: C64.1 C65.2 C66.2 C67.2 C68.- C69.2 C70.2 C71.1 C72.1 C73.2 C74.1 C75.1 C76.2 C77.1 C78.1 C79.1 C80.1 C81.1 C82.1 IC13.4(B:VSS) IC14.10(VSS) IC14.15(A0) IC14.16(A1) IC14.17(A2) IC15.4(GND) IC16.2(GND) IC17.8(GND) IC18.2(GND) IC19.3(CLK) IC19.4(DGND) IC19.5(AVSS) IC19.8(REFN0) R73.2 R79.1 X3.2 ZD3.1(A) ZD3.2(A) ; also sheet 1,2,3,5,6
I_MON: R81.1 ; also sheet 3
I_SET: IC17.4(VOUTA) R77.1 ; also sheet 3
IRQ: IC14.20(INTA) ; also sheet 2
MISO: IC14.14(SO) IC16.4(SI/O) IC19.15(DOUT/!DRDY) ; also sheet 2
MOSI: IC14.13(SI) IC17.7(DIN) IC19.16(DIN) ; also sheet 2
N$12: LED1.CC(C) R73.1
N$17: R75.2 R76.1
N$32: R76.2 X3.1
N$42: Q14.3(D) R74.2
N$56: D15.A D16.A IC13.6(A:!CLR) R71.2
N$70: C80.2 C81.2 IC19.12(AVDD) R82.2
N$71: C70.1 IC15.5(TRIM/NR)
N$72: C74.2 IC19.10(AIN1) R77.2
N$73: C77.2 IC19.11(AIN0/REFP1) R80.2
N$80: C75.2 IC19.7(AIN2) R78.2
N$81: C76.1 IC19.6(AIN3/REFN1) R81.2
N$121: LED2.BC(-BTM:C) R79.2
OE: IC14.2(GPB1) OE.1
OE_GREEN: IC14.7(GPB6) LED1.GREEN(AG)
OE_RED: IC14.8(GPB7) LED1.RED(AR)
OE_TRIG: IC13.1(A:CLK) ; also sheet 2
OVP_EN: IC14.5(GPB4) ; also sheet 5
POST_OE: IC13.5(A:Q) ; also sheet 3
PRE_OE: IC13.2(A:D) OE.2 ; also sheet 1
PWRGOOD: D15.C IC14.24(GPA3) ; also sheet 2
RSENSE: IC14.3(GPB2) ; also sheet 6
SCLK: IC14.12(SCK) IC16.3(SCLK) IC17.6(SCLK) IC19.1(SCLK) ; also sheet 2
SENSE_ERR: IC14.21(GPA0) ; also sheet 6
TEMP_CS: IC16.1(!CS) ; also sheet 2
U_MON: R80.1 ; also sheet 3,5
U_SET: IC17.3(VOUTB) IC18.3(NC) R78.1
U_SET_OUT: IC18.4(COM) ; also sheet 3,5
V+: C66.1 C69.1 C71.2 C73.1 IC15.2(VIN) IC17.1(VDD) IC18.5(VDD) R82.1 ; also sheet 2,3,5
Unconnected: IC13.3(A:!Q) IC14.6(GPB5) IC14.19(INTB) IC15.3(TEMP)

### Notes on the sheet
- Digital control (SPI)
- I/O Expander
- Bit | Function | Direction
- 0 | Sense error | Input
- 1 | CC | Input
- 2 | CV | Input
- 3 | Power good | Input
- 4 | ADC DRDY | Input
- 5 | OVP Fault | Input
- 6 | Current range 50 mA | Output
- 7 | Current range 5 A | Output
- 8 | Down programmer disable | Output
- 9 | Output enable | Output
- 10 | Remote sense | Output
- 11 | Remote programming | Output
- 12 | OVP enable | Output
- 13 | - | -
- 14 | OE uncoupled LED | Output
- Down-programmer | 15 | OE coupled LED | Output
- Require SPI_MODE0
- Voltage reference
- +2.5 V
- Voltage programming selection (DAC / Ext.)
- Require SPI_MODE1
- SPI I/O expander, temp sensor, DAC, ADC, 
  Voltage reference, Remote programming
- Require SPI_MODE1
- ADC Ch | Signal
- AIN0 | U_MON
- AIN1 | I_SET
- AIN2 | U_SET
- Licensed under the TAPR Open Hardware License (www.tapr.org/OHL)
- ADC fmod = 256 kHz (normal), 512 kHz (turbo)
  Anti-aliasing RC filter cutoff = 15.4 kHz
- More info at http://www.envox.hr/eez | AIN3 | I_MON
- Repository: https://github.com/eez-open

## Sheet 5 of 6: CC/CV, OVP
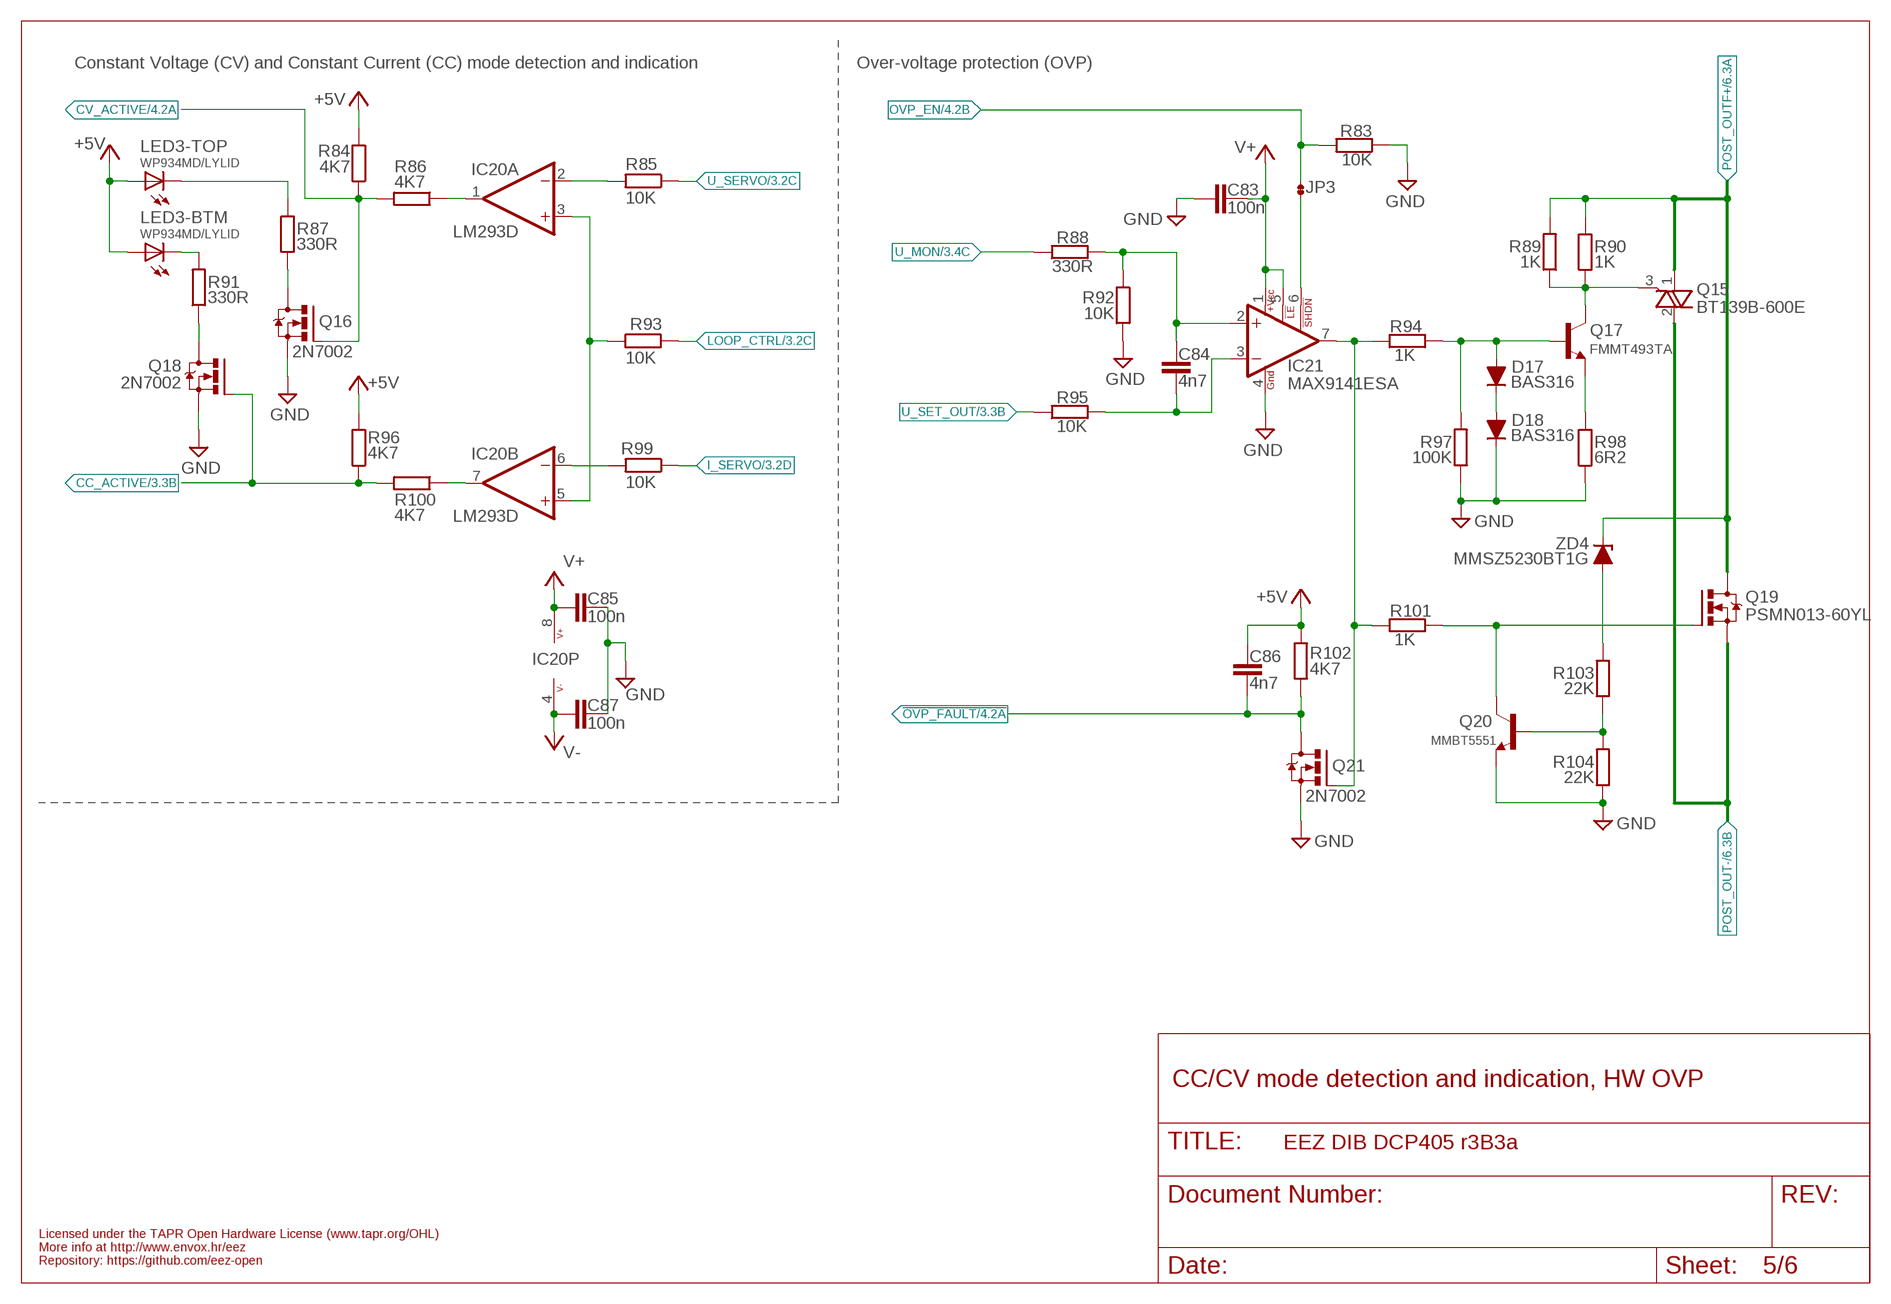
[diagram p4: schematic, sheet 5]

### Parts
C83  100n  C-EUC0603  [C0603]
C84  4n7  C-EUC0805  [C0805]
C85  100n  C-EUC0603  [C0603]
C86  4n7  C-EUC0805  [C0805]
C87  100n  C-EUC0603  [C0603]
D17  BAS316  DIODESOD323R  [SOD323-R]
D18  BAS316  DIODESOD323R  [SOD323-R]
IC20  LM293D  [SOIC127P600X173-8N]
IC21  MAX9141ESA  [SOIC127P600X173-8N]
JP3  JP2-NOCUT-0805  [JP2-0805-NOCUT]
LED3  WP934MD/LYLID  [WP934MD]
Q15  BT139B-600E  BT139  [D2PAK]
Q16  2N7002  [SOT103P240X110-3N]
Q17  FMMT493TA  MMBT5551LT1-NPN-SOT23-BEC  [SOT23-BEC]
Q18  2N7002  [SOT103P240X110-3N]
Q19  PSMN013-60YL  N-MOSFETLFPAK  [SOT669]
Q20  MMBT5551  MMBT5551LT1-NPN-SOT23-BEC  [SOT23-BEC]
Q21  2N7002  [SOT103P240X110-3N]
R83  10K  R-EU_R0805  [R0805]
R84  4K7  R-EU_R0805  [R0805]
R85  10K  R-EU_R0805  [R0805]
R86  4K7  R-EU_R0805  [R0805]
R87  330R  R-EU_R0805  [R0805]
R88  330R  R-EU_R0805  [R0805]
R89  1K  R-EU_R0805  [R0805]
R90  1K  R-EU_R0805  [R0805]
R91  330R  R-EU_R0805  [R0805]
R92  10K  R-EU_R0805  [R0805]
R93  10K  R-EU_R0805  [R0805]
R94  1K  R-EU_R0805  [R0805]
R95  10K  R-EU_R0805  [R0805]
R96  4K7  R-EU_R0805  [R0805]
R97  100K  R-EU_R0805  [R0805]
R98  6R2  R-EU_R0805  [R0805]
R99  10K  R-EU_R0805  [R0805]
R100  4K7  R-EU_R0805  [R0805]
R101  1K  R-EU_R0805  [R0805]
R102  4K7  R-EU_R0805  [R0805]
R103  22K  R-EU_R0805  [R0805]
R104  22K  R-EU_R0805  [R0805]
ZD4  MMSZ5230BT1G  ZENER-DIODESOD123  [SOD123]

### Nets
!OVP_FAULT: C86.2 Q21.3(D) R102.2 ; also sheet 4
+5V: C86.1 LED3.BA(-BTM:A) LED3.TA(-TOP:A) R84.2 R96.2 R102.1 ; also sheet 2,4,6
CC_ACTIVE: Q18.1(G) R96.1 R100.2 ; also sheet 3,4
CC_LED: LED3.BC(-BTM:C) R91.2
CV_ACTIVE: Q16.1(G) R84.1 R86.2 ; also sheet 4
CV_LED: LED3.TC(-TOP:C) R87.1
D_CC: Q18.3(D) R91.1
D_CV: Q16.3(D) R87.2
GND: C83.1 C85.1 C87.1 D18.C IC21.4(GND) Q16.2(S) Q18.2(S) Q20.E Q21.2(S) R83.1 R92.2 R97.1 R98.1 R104.1 ; also sheet 1,2,3,4,6
I_SERVO: R99.1 ; also sheet 3
LOOP_CTRL: R93.2 ; also sheet 3
N$1: IC21.6(!SHDN) JP3.2
N$13: IC21.7(OUT) Q21.1(G) R94.2 R101.2
N$18: Q15.3(G) Q17.C R89.1 R90.1
N$19: Q17.E R98.2
N$20: D17.C D18.A
N$21: D17.A Q17.B R94.1 R97.2
N$24: R103.2 ZD4.A
N$28: Q20.B R103.1 R104.2
N$44: Q19.4(G) Q20.C R101.1
N$105: IC20.1(A:OUT) R86.1
N$106: IC20.7(B:OUT) R100.1
N$153: IC20.2(A:-IN) R85.2
N$161: IC20.6(B:-IN) R99.2
N$170: IC20.3(A:+IN) IC20.5(B:+IN) R93.1
OVP_EN: JP3.1 R83.2 ; also sheet 4
OVP_IN+: C84.1 IC21.2(+IN) R88.2 R92.1
OVP_IN-: C84.2 IC21.3(-IN) R95.2
POST_OUT-: Q15.2(A2) Q19.1(S) Q19.2(S) Q19.3(S) ; also sheet 3,6
POST_OUTF+: Q15.1(A1) Q19.MB(D) R89.2 R90.2 ZD4.C ; also sheet 6
U_MON: R88.1 ; also sheet 3,4
U_SERVO: R85.1 ; also sheet 3
U_SET_OUT: R95.1 ; also sheet 3,4
V+: C83.2 C85.2 IC20.8(P:V+) IC21.1(+VCC) IC21.5(!LE) ; also sheet 2,3,4
V-: C87.2 IC20.4(P:V-) ; also sheet 2,3

### Notes on the sheet
- Constant Voltage (CV) and Constant Current (CC) mode detection and indication | Over-voltage protection (OVP)
- CC/CV mode detection and indication, HW OVP
- Licensed under the TAPR Open Hardware License (www.tapr.org/OHL)
- More info at http://www.envox.hr/eez
- Repository: https://github.com/eez-open

## Sheet 6 of 6: Rsense protection, power output
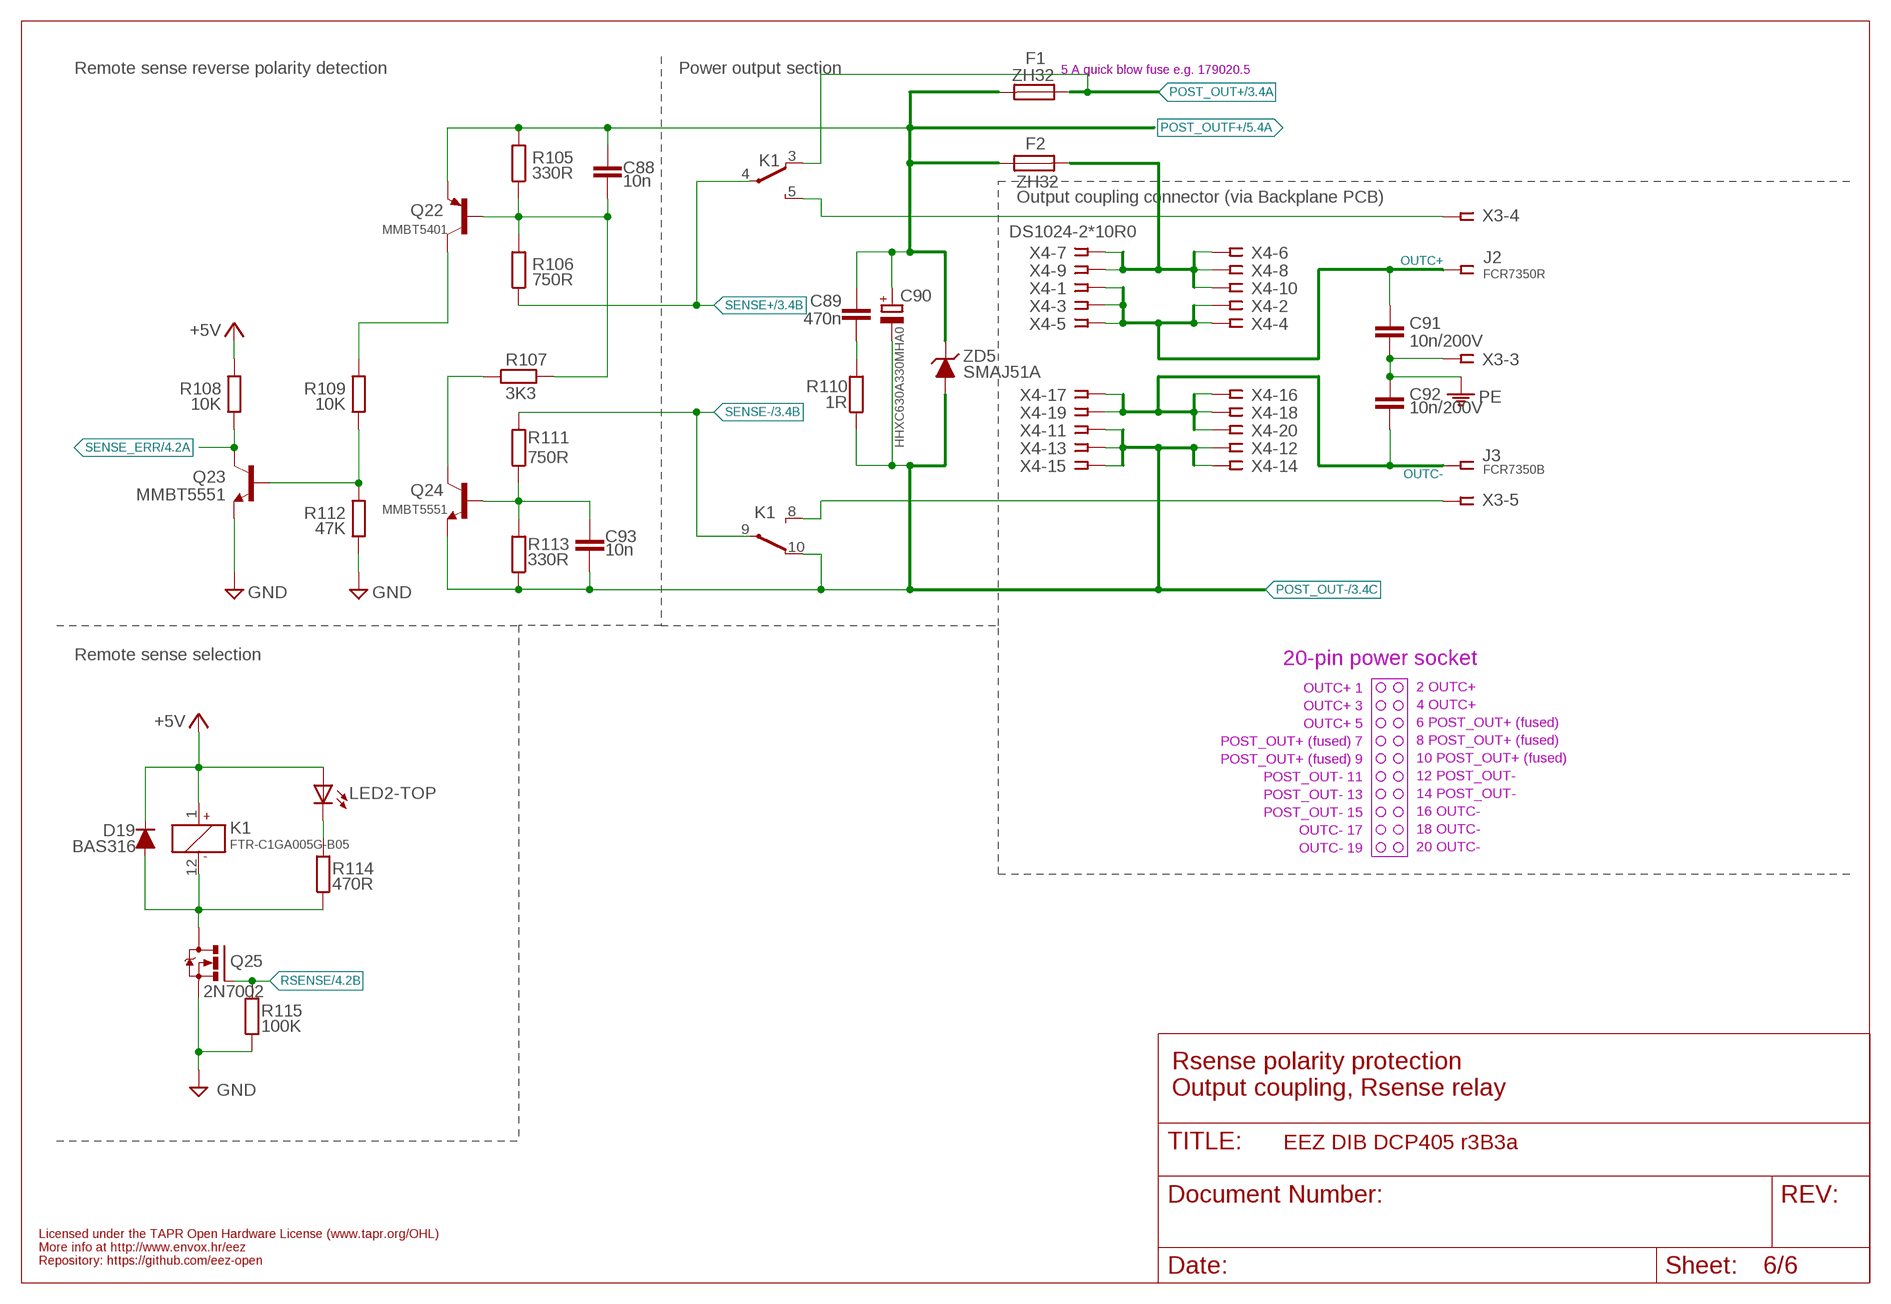
[diagram p5: schematic, sheet 6]

### Parts
C88  10n  C-EUC0805  [C0805]
C89  470n  C-EUC0805  [C0805]
C90  HHXC630A330MHA0  ECAPSMD8.3MM/HA0  [CAPAE830X1050N]
C91  10n/200V  C-EUC1206  [C1206]
C92  10n/200V  C-EUC1206  [C1206]
C93  10n  C-EUC0805  [C0805]
D19  BAS316  DIODESOD323R  [SOD323-R]
F1  ZH32  [ZH32]
F2  ZH32  [ZH32]
J2  FCR7350R  BINDING_POSTCLIFF  [S16N-PC]
J3  FCR7350B  BINDING_POSTCLIFF  [S16N-PC]
K1  FTR-C1GA005G-B05  FTR-C1  [FTR-C1]
Q22  MMBT5401  BC857B-PNP-SOT23-BEC  [SOT23-BEC]
Q23  MMBT5551  MMBT5551LT1-NPN-SOT23-BEC  [SOT23-BEC]
Q24  MMBT5551  MMBT5551LT1-NPN-SOT23-BEC  [SOT23-BEC]
Q25  2N7002  [SOT103P240X110-3N]
R105  330R  R-EU_R0805  [R0805]
R106  750R  R-EU_R0805  [R0805]
R107  3K3  R-EU_R0805  [R0805]
R108  10K  R-EU_R0805  [R0805]
R109  10K  R-EU_R0805  [R0805]
R110  1R  R-EU_R1206  [R1206]
R111  750R  R-EU_R0805  [R0805]
R112  47K  R-EU_R0805  [R0805]
R113  330R  R-EU_R0805  [R0805]
R114  470R  R-EU_R0805  [R0805]
R115  100K  R-EU_R0805  [R0805]
X4  DS1024-2*10R0  SSW-110-02-T-D-RA  [SSW-110-02-T-D-RA]
ZD5  SMAJ51A  P6SMB68A  [DO214AA]

### Nets
+5V: D19.C K1.1(C1) LED2.TA(-TOP:A) R108.2 ; also sheet 2,4,5
GND: Q23.E Q25.2(S) R112.1 R115.1 ; also sheet 1,2,3,4,5
N$107: C88.2 Q22.B R105.1 R106.2 R107.2
N$108: Q22.C R109.2
N$109: Q24.C R107.1
N$110: C93.1 Q24.B R111.1 R113.2
N$112: Q23.B R109.1 R112.2
N$113: C89.2 R110.2
N$114: D19.A K1.12(C2) Q25.3(D) R114.1
N$115: K1.5(-1:NO) X3.4
N$116: K1.8(-2:NO) X3.5
N$120: LED2.TC(-TOP:C) R114.2
OUTC+: C91.1 J2.1 X4.1 X4.2 X4.3 X4.4 X4.5
OUTC-: C92.2 J3.1 X4.16 X4.17 X4.18 X4.19 X4.20
OUTF+: F2.2 X4.6 X4.7 X4.8 X4.9 X4.10
PE: C91.2 C92.1 X3.3 ; also sheet 1
POST_OUT+: F1.1 K1.3(-1:NC) ; also sheet 1,3
POST_OUT-: C90.- C93.2 K1.10(-2:NC) Q24.E R110.1 R113.1 X4.11 X4.12 X4.13 X4.14 X4.15 ZD5.A ; also sheet 3,5
POST_OUTF+: C88.1 C89.1 C90.+ F1.2 F2.1 Q22.E R105.2 ZD5.C ; also sheet 5
RSENSE: Q25.1(G) R115.2 ; also sheet 4
SENSE+: K1.4(-1:COM) R106.1 ; also sheet 3
SENSE-: K1.9(-2:COM) R111.2 ; also sheet 3
SENSE_ERR: Q23.C R108.1 ; also sheet 4

### Notes on the sheet
- Remote sense reverse polarity detection | Power output section | 5 A quick blow fuse e.g. 179020.5
- Output coupling connector (via Backplane PCB)
- Remote sense selection | 20-pin power socket
- OUTC+ 1
- 2 OUTC+
- OUTC+ 3
- 4 OUTC+
- OUTC+ 5
- 6 POST_OUT+ (fused)
- POST_OUT+ (fused) 7
- 8 POST_OUT+ (fused)
- POST_OUT+ (fused) 9
- 10 POST_OUT+ (fused)
- POST_OUT- 11
- 12 POST_OUT-
- POST_OUT- 13
- 14 POST_OUT-
- POST_OUT- 15
- 16 OUTC-
- OUTC- 17
- 18 OUTC-
- OUTC- 19
- 20 OUTC-
- Rsense polarity protection
  Output coupling, Rsense relay
- Licensed under the TAPR Open Hardware License (www.tapr.org/OHL)
- More info at http://www.envox.hr/eez
- Repository: https://github.com/eez-open

## Library data of the parts
C1-C3 C5-C7 C7A C8-C14 C17-C62 C64-C67 C69-C89 C91-C93 = rcl:C-EU: CAPACITOR, European symbol
C4 C15 C16 C68 C90 = EEZ_Lib1:ECAP
D1 D3 D10-D13 D15-D19 = EEZ_Lib1:DIODE
D2 D4-D9 D14 = EEZ_Lib1:SCHOTTKY
F1 F2 = EEZ_Lib1:ZH32: Fuse holder with cover; tube fuses; 5x20mm
FB1-FB3 = EEZ_Lib1:FERRITE_BEAD: FAIR-RITE - 2506033007Y3 - FERRITE BEAD, 0.04OHM, 3A, 0603 Farnell: 2112873
FM1-FM3 = EEZ_Lib1:FIDUCIAL: Fiducial mark for pick and place automation
GND = EEZ_Lib1:PCB_TEST_TAB
IC1 = EEZ_TI:LM5145: 6-V to 75-V Synchronous Buck DC-DC Controller With Wide Duty Cycle Range
IC2 = EEZ_Lib1:TPS54060: 0.5A, 60V Step Down SWIFT DC/DC Converter with ECO-MODE,MSOP-10; MPN: TPS54060ADGQ; OC_FARNELL: 2099922; OC_NEWARK: 05W5854; PACKAGE: MSOP-10; SUPPLIER: TEXAS INSTRUMENTS
IC3 IC7 = EEZ_Lib1:SI8641: Low power 4-ch digital isolator (3+1) Farnell: 2423288
IC4 = EEZ_DIB:SN74LVC1G139: 2-to-4 Line Decoder
IC5 = EEZ_Lib1:MC78LXX: μA78L00 series positive voltage regulators
IC6 = EEZ_Lib1:MC79LXX: 3-terminal negative voltage regulator, up to 100mA
IC8 = EEZ_Lib1:AT24CXX: I2C-Compatible (2-wire) Serial EEPROM
IC9 IC10 = EEZ_Lib1:TL072
IC11 = EEZ_Lib1:OP27GSZ: Low Noise, Precision Operational Amplifier
IC12 IC18 = EEZ_Lib1:SN74LVC1G3157
IC13 = EEZ_Lib1:SN74LVC1G74DCTR: Single Positive-Edge-Triggered D-Type Flip-Flop with Clear and Preset
IC14 = EEZ_Lib1:MCP23S17-E/SS: 16-Bit I/O Expander with Serial Interface; FARNELL: 1467675; TME: MCP23S17-E/SS
IC15 = EEZ_Lib1:REF50XX: Low-Noise (3μVpp/V), Very Low Drift (max. 8ppm/°C), Precision Voltage Reference Pin compatible with REF2 Farnell: 1439628
IC16 = EEZ_Lib1:TC77: Thermal Sensor with SPI Interface
IC17 = EEZ_Lib1:DAC8552_DGK_8
IC19 = EEZ_Lib1:ADS1120: Low-Power, Low-Noise, 16-Bit, Analog-to-Digital Converter for Small-Signal Sensors Farnell: 2402249
IC20 = EEZ_Lib1:LM293: Dual Differential Comparators
IC21 = EEZ_Lib1:MAX9141: 40ns, Low-Power, 3V/5V, Rail-to-Rail Single-Supply Comparator
J1 = EEZ_connectors:PCB_TAB: PCB quick-fit terminal
J2 J3 = EEZ_connectors:BINDING_POST: Various 4 mm binding posts
JP1 = EEZ_Lib1:JP2-CUT
JP3 OE = EEZ_Lib1:JP2-NOCUT
K1 = EEZ_switches:FTR-C1: Power relay, 2 poles, 2A high insulation/wide gap
KK1 KK2 = EEZ_Lib1:PCB-MB: Richo Mounting Block; 16 x 6 mm
KK3 = EEZ_Lib1:SK96/84
L1 = EEZ_Lib1:RN112
L2 = EEZ_inductors_and_transformers:PANASONIC_ETQ-P4_KFM: Panasonic power choke coil automative grade 7.4x7.4mm
L3 = EEZ_inductors_and_transformers:COILCRAFT_HPI0630: High power inductor
LED1 = EEZ_Lib1:LED_L-42WUM/1EGWT: 3 mm right angle bicolor LED indicator
LED2 LED3 = EEZ_Lib1:WP934MD: Kingbright LED; in housing; 3mm; No.of diodes:2
OSHWA = EEZ_Lib1:OSHWA-CERT
Q1 Q2 Q12 Q13 Q19 = EEZ_Lib1:N-MOSFET
Q3 Q8 Q22 = transistor:*-PNP-: PNP Transistror
Q4 Q5 = EEZ_Lib1:D45H11
Q6 = EEZ_Lib1:P-MOSFET: HEXFET Power MosFet Source: http://www.irf.com/
Q7 = EEZ_Lib1:BCP56: Low power NPN Transistor, Vceo=80V, Ic=1A, SOT-223
Q9 = EEZ_Lib1:NZT605: NPN Darlington Transistor
Q10 Q11 Q16 Q18 Q21 Q25 = EEZ_Lib1:2N7002: N-CHANNEL ENHANCEMENT MODE FIELD EFFECT TRANSISTOR; MPN: 2N7002-7-F; OC_FARNELL: 1713823; OC_NEWARK: 25R5679; PACKAGE: SOT-23-3; SUPPLIER: DIODES INC.
Q14 = EEZ_Lib1:IRLML2246TRPBF: HEXFET Power MOSFET (-20V, -2.6A); MPN: IRLML2246TRPBF; OC_FARNELL: 1888166; OC_NEWARK: 40T7450; PACKAGE: SOT-3; SUPPLIER: International Rectifier; TME: IRLML2246TRPBF
Q15 = EEZ_Lib1:BT139: 4Q Triac
Q17 Q20 Q23 Q24 = transistor:*-NPN-: NPN Transistror BF959 corrected 2008.03.06
R1-R66 R68-R115 = rcl:R-EU_: RESISTOR, European symbol
R67 = EEZ_Lib1:R-EU_4WIRE
RN1-RN3 = EEZ_Lib1:R_ARRAY4: 1206 four resistor array
SH1 SH2 = EEZ_Lib1:SHORT
TP1-TP3 = EEZ_connectors:TEST-PIN: Test pin
TR1 = EEZ_inductors_and_transformers:BOURNS_SRF0703INV: Bourns SRF0703 Series - Dual-Winding Shielded Power Inductors
X1 = EEZ_connectors:MINIFIT_39301020: Molex Socket; wire-board; male; Mini-Fit Jr; 4.2mm; PIN:2; THT; PCB snap
X2 = EEZ_connectors:77317-104-20LF: Headers & Wire Housings 20P right angle 0.1" pitch
X3 = EEZ_connectors:MC1,5/5-G-3,5: Pluggable Terminal Blocks, angled, 5-pin 3.5mm pitch Through Hole Header
X4 = EEZ_connectors:SSW-110-02-T-D-RA: Samtec SSW-113-02-T-D-RA Receptacle, 2.54MM, RA, 20-way
ZD1 ZD5 = EEZ_Lib1:P6SMB68A: Transient Voltage Suppression Diodes, DO-214AA
ZD2 ZD4 = EEZ_Lib1:ZENER-DIODE
ZD3 = EEZ_Lib1:SLVU2.8: 2.8Volts ESD Protection Devices

## Net classes
0 default: width 0.203 mm, drill 0.3 mm, clearance 0.203 mm
1 lvds: width 0.152 mm, drill 0.3 mm, clearance 0.152 mm to class 0, clearance 0.152 mm
2 gnd: width 0.254 mm, drill 0.584 mm, clearance 0.254 mm